# Altium schematic sheet Sheet.SchDoc
size A4; SheetNumber: 1; SheetTotal: 1
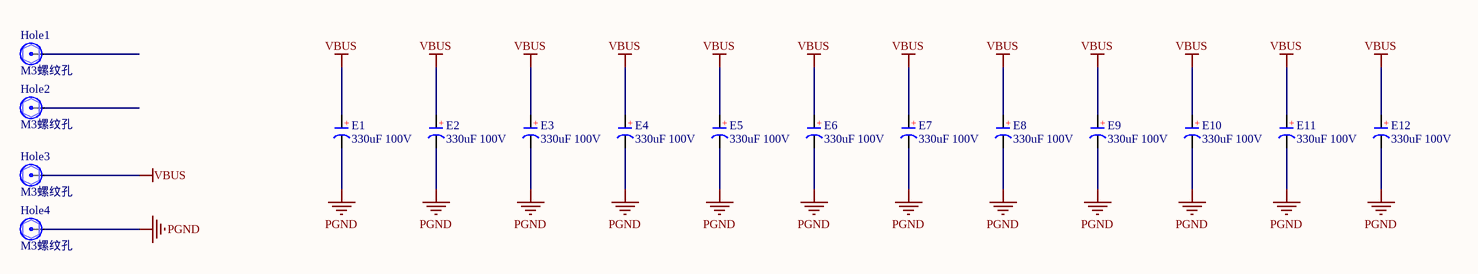
[diagram p0: Sheet.SchDoc]

## Parts
E1  330uF 100V  [13*25插件电解电容 卧式]
E2  330uF 100V  [13*25插件电解电容 卧式]
E3  330uF 100V  [13*25插件电解电容 卧式]
E4  330uF 100V  [13*25插件电解电容 卧式]
E5  330uF 100V  [13*25插件电解电容 卧式]
E6  330uF 100V  [13*25插件电解电容 卧式]
E7  330uF 100V  [13*25插件电解电容 卧式]
E8  330uF 100V  [13*25插件电解电容 卧式]
E9  330uF 100V  [13*25插件电解电容 卧式]
E10  330uF 100V  [13*25插件电解电容 卧式]
E11  330uF 100V  [13*25插件电解电容 卧式]
E12  330uF 100V  [13*25插件电解电容 卧式]
Hole1  M3螺纹孔  [M3_3*7载流孔_螺丝]
Hole2  M3螺纹孔  [M3_3*7载流孔_螺丝]
Hole3  M3螺纹孔  [M3_3*7载流孔_螺丝]
Hole4  M3螺纹孔  [M3_3*7载流孔_螺丝]

## Nets
PGND: E1.2(K) E2.2(K) E3.2(K) E4.2(K) E5.2(K) E6.2(K) E7.2(K) E8.2(K) E9.2(K) E10.2(K) E11.2(K) E12.2(K) Hole4.1
VBUS: E1.1(A) E2.1(A) E3.1(A) E4.1(A) E5.1(A) E6.1(A) E7.1(A) E8.1(A) E9.1(A) E10.1(A) E11.1(A) E12.1(A) Hole3.1

Not connected (* = marked no-connect by the designer): Hole1 1; Hole2 1

## Notes on the sheet
- (in symbol C-CD) +

## Library data of the parts
E1-E12 = C-CD: 贴片钽电容; 版权归属: 源创客; BOM名称: 贴片钽电容; 学习资源: www.ooocke.com